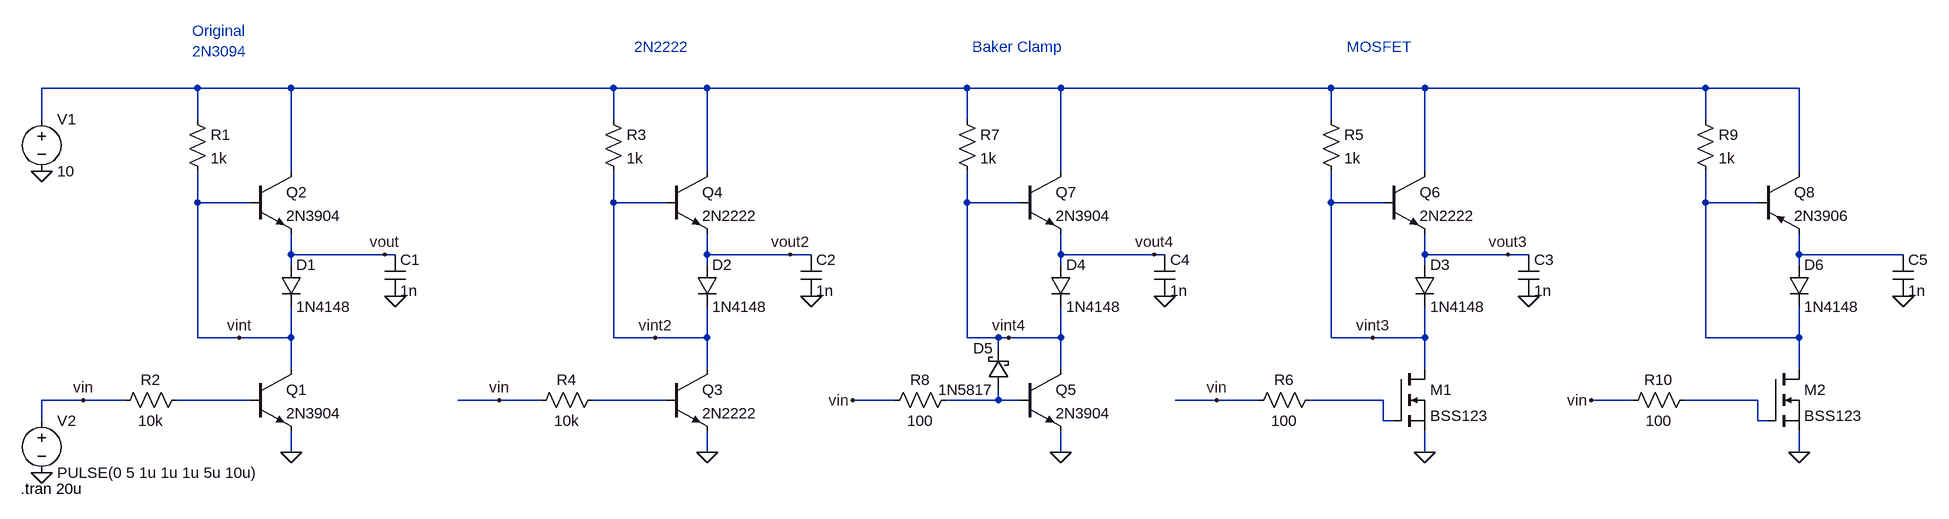
[diagram p0: schematic push-pull.asc]
push-pull.asc, the LTspice schematic file:
Version 4
SHEET 1 2700 680
WIRE 32 -240 -208 -240
WIRE 176 -240 32 -240
WIRE 672 -240 176 -240
WIRE 816 -240 672 -240
WIRE 1216 -240 816 -240
WIRE 1360 -240 1216 -240
WIRE 1776 -240 1360 -240
WIRE 1920 -240 1776 -240
WIRE 2352 -240 1920 -240
WIRE 2496 -240 2352 -240
WIRE -208 -192 -208 -240
WIRE 32 -192 32 -240
WIRE 672 -192 672 -240
WIRE 1216 -192 1216 -240
WIRE 1776 -192 1776 -240
WIRE 2352 -192 2352 -240
WIRE 176 -112 176 -240
WIRE 816 -112 816 -240
WIRE 1360 -112 1360 -240
WIRE 1920 -112 1920 -240
WIRE 2496 -112 2496 -240
WIRE 32 -64 32 -112
WIRE 112 -64 32 -64
WIRE 672 -64 672 -112
WIRE 752 -64 672 -64
WIRE 1216 -64 1216 -112
WIRE 1296 -64 1216 -64
WIRE 1776 -64 1776 -112
WIRE 1856 -64 1776 -64
WIRE 2352 -64 2352 -112
WIRE 2432 -64 2352 -64
WIRE 176 16 176 -16
WIRE 320 16 176 16
WIRE 336 16 320 16
WIRE 816 16 816 -16
WIRE 944 16 816 16
WIRE 976 16 944 16
WIRE 1360 16 1360 -16
WIRE 1504 16 1360 16
WIRE 1520 16 1504 16
WIRE 1920 16 1920 -16
WIRE 2048 16 1920 16
WIRE 2080 16 2048 16
WIRE 2496 16 2496 -16
WIRE 2656 16 2496 16
WIRE 176 32 176 16
WIRE 816 32 816 16
WIRE 1360 32 1360 16
WIRE 1920 32 1920 16
WIRE 2496 32 2496 16
WIRE 32 144 32 -64
WIRE 96 144 32 144
WIRE 176 144 176 96
WIRE 176 144 96 144
WIRE 672 144 672 -64
WIRE 736 144 672 144
WIRE 816 144 816 96
WIRE 816 144 736 144
WIRE 1216 144 1216 -64
WIRE 1264 144 1216 144
WIRE 1280 144 1264 144
WIRE 1360 144 1360 96
WIRE 1360 144 1280 144
WIRE 1776 144 1776 -64
WIRE 1840 144 1776 144
WIRE 1920 144 1920 96
WIRE 1920 144 1840 144
WIRE 2352 144 2352 -64
WIRE 2496 144 2496 96
WIRE 2496 144 2352 144
WIRE 1264 160 1264 144
WIRE 176 192 176 144
WIRE 816 192 816 144
WIRE 1360 192 1360 144
WIRE 1920 192 1920 144
WIRE 2496 192 2496 144
WIRE -144 240 -208 240
WIRE -80 240 -144 240
WIRE 112 240 0 240
WIRE 496 240 432 240
WIRE 560 240 496 240
WIRE 752 240 640 240
WIRE 1104 240 1040 240
WIRE 1264 240 1264 224
WIRE 1264 240 1184 240
WIRE 1296 240 1264 240
WIRE 1600 240 1536 240
WIRE 1664 240 1600 240
WIRE 1856 240 1744 240
WIRE 2240 240 2176 240
WIRE 2432 240 2320 240
WIRE -208 272 -208 240
WIRE 1856 272 1856 240
WIRE 1872 272 1856 272
WIRE 2432 272 2432 240
WIRE 2448 272 2432 272
WIRE 176 320 176 288
WIRE 816 320 816 288
WIRE 1360 320 1360 288
WIRE 1920 320 1920 288
WIRE 2496 320 2496 288
FLAG 176 320 0
FLAG -208 -112 0
FLAG -208 352 0
FLAG 336 80 0
FLAG 320 16 vout
FLAG 96 144 vint
FLAG -144 240 vin
FLAG 816 320 0
FLAG 976 80 0
FLAG 736 144 vint2
FLAG 944 16 vout2
FLAG 496 240 vin
FLAG 1920 320 0
FLAG 2080 80 0
FLAG 1840 144 vint3
FLAG 2048 16 vout3
FLAG 1600 240 vin
FLAG 1360 320 0
FLAG 1520 80 0
FLAG 1504 16 vout4
FLAG 1280 144 vint4
FLAG 1040 240 vin
FLAG 2496 320 0
FLAG 2656 80 0
FLAG 2176 240 vin
SYMBOL npn 112 192 R0
SYMATTR InstName Q1
SYMATTR Value 2N3904
SYMBOL npn 112 -112 R0
SYMATTR InstName Q2
SYMATTR Value 2N3904
SYMBOL diode 160 32 R0
SYMATTR InstName D1
SYMATTR Value 1N4148
SYMBOL res 16 -208 R0
SYMATTR InstName R1
SYMATTR Value 1k
SYMBOL voltage -208 -208 R0
WINDOW 123 0 0 Left 0
WINDOW 39 0 0 Left 0
SYMATTR InstName V1
SYMATTR Value 10
SYMBOL voltage -208 256 R0
WINDOW 123 0 0 Left 0
WINDOW 39 0 0 Left 0
SYMATTR InstName V2
SYMATTR Value PULSE(0 5 1u 1u 1u 5u 10u)
SYMBOL res 16 224 R90
WINDOW 0 0 56 VBottom 2
WINDOW 3 32 56 VTop 2
SYMATTR InstName R2
SYMATTR Value 10k
SYMBOL cap 320 16 R0
SYMATTR InstName C1
SYMATTR Value 1n
SYMBOL npn 752 192 R0
SYMATTR InstName Q3
SYMATTR Value 2N2222
SYMBOL npn 752 -112 R0
SYMATTR InstName Q4
SYMATTR Value 2N2222
SYMBOL diode 800 32 R0
SYMATTR InstName D2
SYMATTR Value 1N4148
SYMBOL res 656 -208 R0
SYMATTR InstName R3
SYMATTR Value 1k
SYMBOL res 656 224 R90
WINDOW 0 0 56 VBottom 2
WINDOW 3 32 56 VTop 2
SYMATTR InstName R4
SYMATTR Value 10k
SYMBOL cap 960 16 R0
SYMATTR InstName C2
SYMATTR Value 1n
SYMBOL npn 1856 -112 R0
SYMATTR InstName Q6
SYMATTR Value 2N2222
SYMBOL diode 1904 32 R0
SYMATTR InstName D3
SYMATTR Value 1N4148
SYMBOL res 1760 -208 R0
SYMATTR InstName R5
SYMATTR Value 1k
SYMBOL res 1760 224 R90
WINDOW 0 0 56 VBottom 2
WINDOW 3 32 56 VTop 2
SYMATTR InstName R6
SYMATTR Value 100
SYMBOL cap 2064 16 R0
SYMATTR InstName C3
SYMATTR Value 1n
SYMBOL nmos 1872 192 R0
SYMATTR InstName M1
SYMATTR Value BSS123
SYMBOL npn 1296 192 R0
SYMATTR InstName Q5
SYMATTR Value 2N3904
SYMBOL npn 1296 -112 R0
SYMATTR InstName Q7
SYMATTR Value 2N3904
SYMBOL diode 1344 32 R0
SYMATTR InstName D4
SYMATTR Value 1N4148
SYMBOL res 1200 -208 R0
SYMATTR InstName R7
SYMATTR Value 1k
SYMBOL res 1200 224 R90
WINDOW 0 0 56 VBottom 2
WINDOW 3 32 56 VTop 2
SYMATTR InstName R8
SYMATTR Value 100
SYMBOL cap 1504 16 R0
SYMATTR InstName C4
SYMATTR Value 1n
SYMBOL schottky 1280 224 R180
WINDOW 0 24 64 Left 2
WINDOW 3 24 0 Left 2
SYMATTR InstName D5
SYMATTR Value 1N5817
SYMATTR Description Diode
SYMATTR Type diode
SYMBOL diode 2480 32 R0
SYMATTR InstName D6
SYMATTR Value 1N4148
SYMBOL res 2336 -208 R0
SYMATTR InstName R9
SYMATTR Value 1k
SYMBOL res 2336 224 R90
WINDOW 0 0 56 VBottom 2
WINDOW 3 32 56 VTop 2
SYMATTR InstName R10
SYMATTR Value 100
SYMBOL cap 2640 16 R0
SYMATTR InstName C5
SYMATTR Value 1n
SYMBOL nmos 2448 192 R0
SYMATTR InstName M2
SYMATTR Value BSS123
SYMBOL pnp 2432 -112 R0
SYMATTR InstName Q8
SYMATTR Value 2N3906
TEXT -240 376 Left 2 !.tran 20u
TEXT 24 -328 Left 2 ;Original\n2N3094
TEXT 704 -304 Left 2 ;2N2222
TEXT 1224 -304 Left 2 ;Baker Clamp
TEXT 1800 -304 Left 2 ;MOSFET

The netlist it stands for:
* push-pull.asc
Q1 vint N004 0 0 2N3904
Q2 N001 vint vout 0 2N3904
D1 vout vint 1N4148
R1 N001 vint 1k
V1 N001 0 10
V2 vin 0 PULSE(0 5 1u 1u 1u 5u 10u)
R2 N004 vin 10k
C1 vout 0 1n
Q3 vint2 N005 0 0 2N2222
Q4 N001 vint2 vout2 0 2N2222
D2 vout2 vint2 1N4148
R3 N001 vint2 1k
R4 N005 vin 10k
C2 vout2 0 1n
Q6 N001 vint3 vout3 0 2N2222
D3 vout3 vint3 1N4148
R5 N001 vint3 1k
R6 N007 vin 100
C3 vout3 0 1n
M1 vint3 N007 0 0 BSS123
Q5 vint4 N006 0 0 2N3904
Q7 N001 vint4 vout4 0 2N3904
D4 vout4 vint4 1N4148
R7 N001 vint4 1k
R8 N006 vin 100
C4 vout4 0 1n
D5 N006 vint4 1N5817
D6 N003 N002 1N4148
R9 N001 N002 1k
R10 N008 vin 100
C5 N003 0 1n
M2 N002 N008 0 0 BSS123
Q8 N001 N002 N003 0 2N3906
.model D D
.lib standard.dio
.model NPN NPN
.model PNP PNP
.lib standard.bjt
.model NMOS NMOS
.model PMOS PMOS
.lib standard.mos
.tran 20u
* Original
* 2N3094
* 2N2222
* Baker Clamp
* MOSFET
.backanno
.end